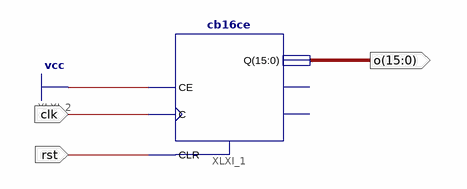
[diagram p0: schematic sheet 1]
// Xilinx ISE schematic test.sch (spartan3e) as structural Verilog: 1 symbols, 3 ports
module test (
  input  clk,
  input  rst,
  output [15:0] o
);

  cb16ce XLXI_1 (.C(clk), .CE(1'b1), .CLR(rst), .Q(o));  // open: CEO, TC
endmodule
